# EAGLE board Aquila-2019-ex (EAGLE 9.2.1), part 1 of 2
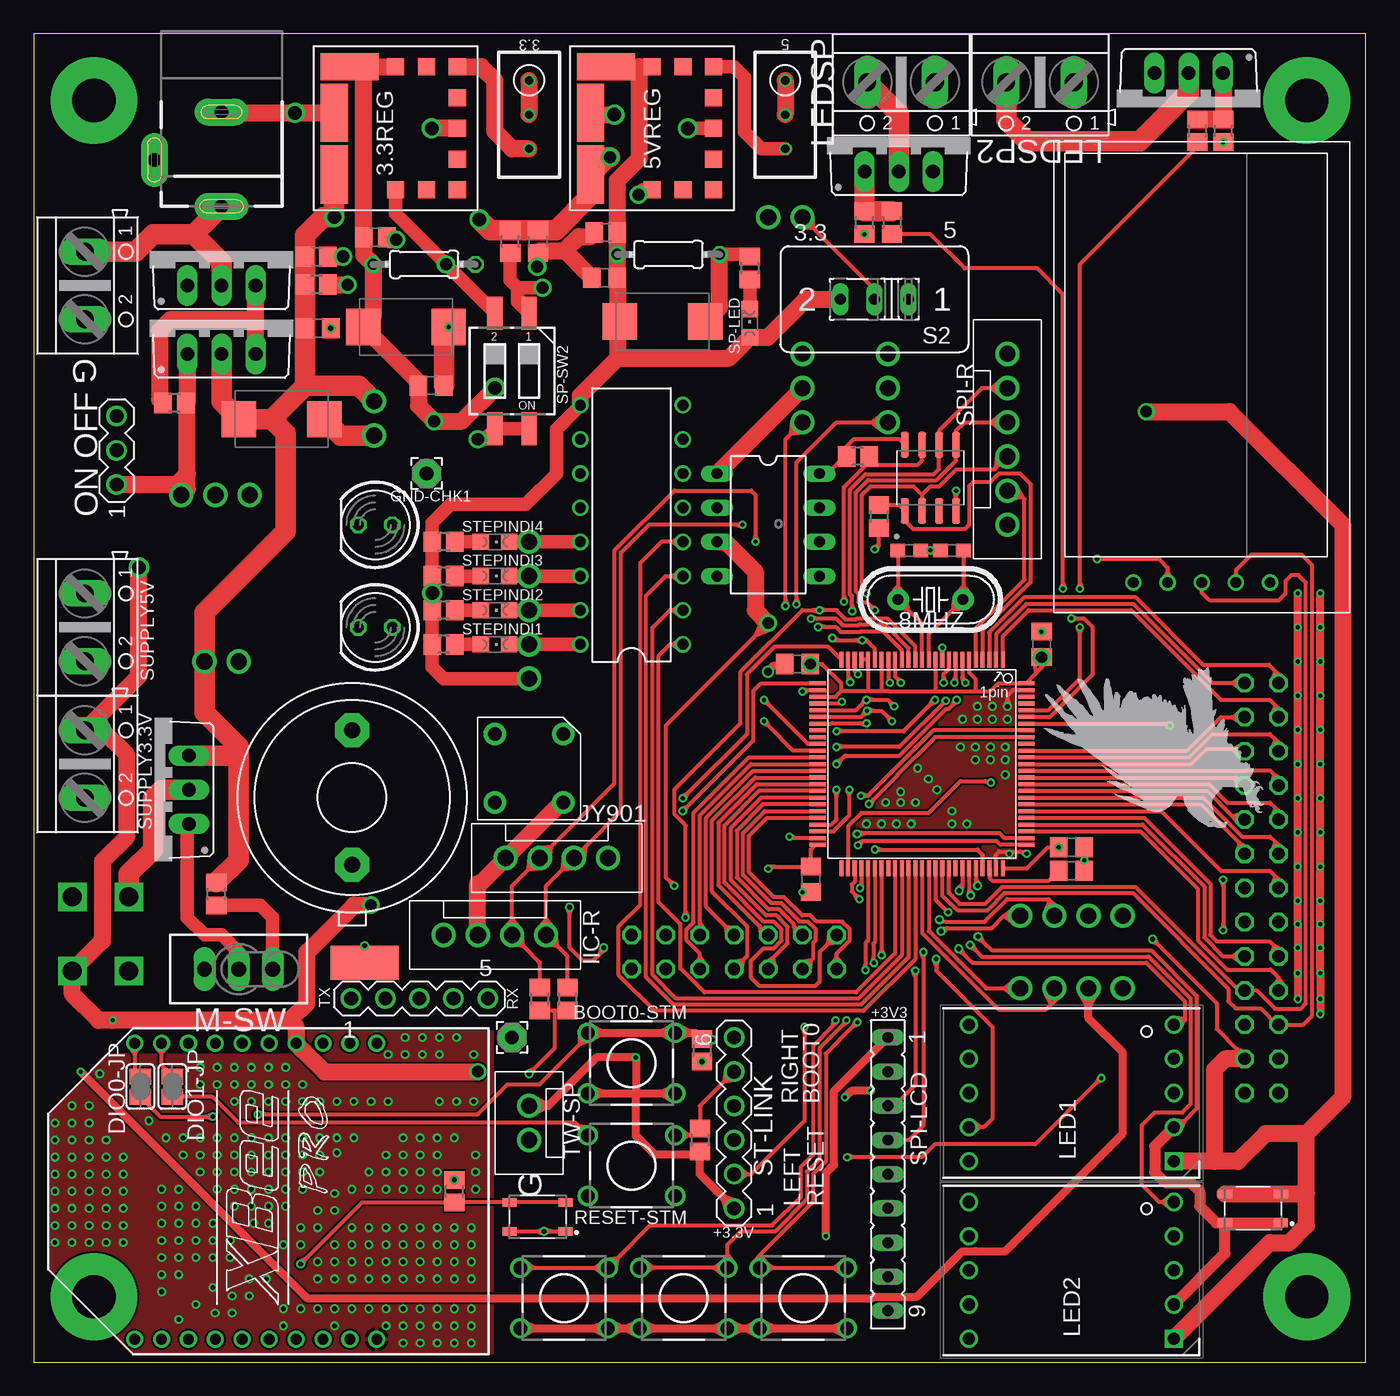
[diagram p6: board, top side]
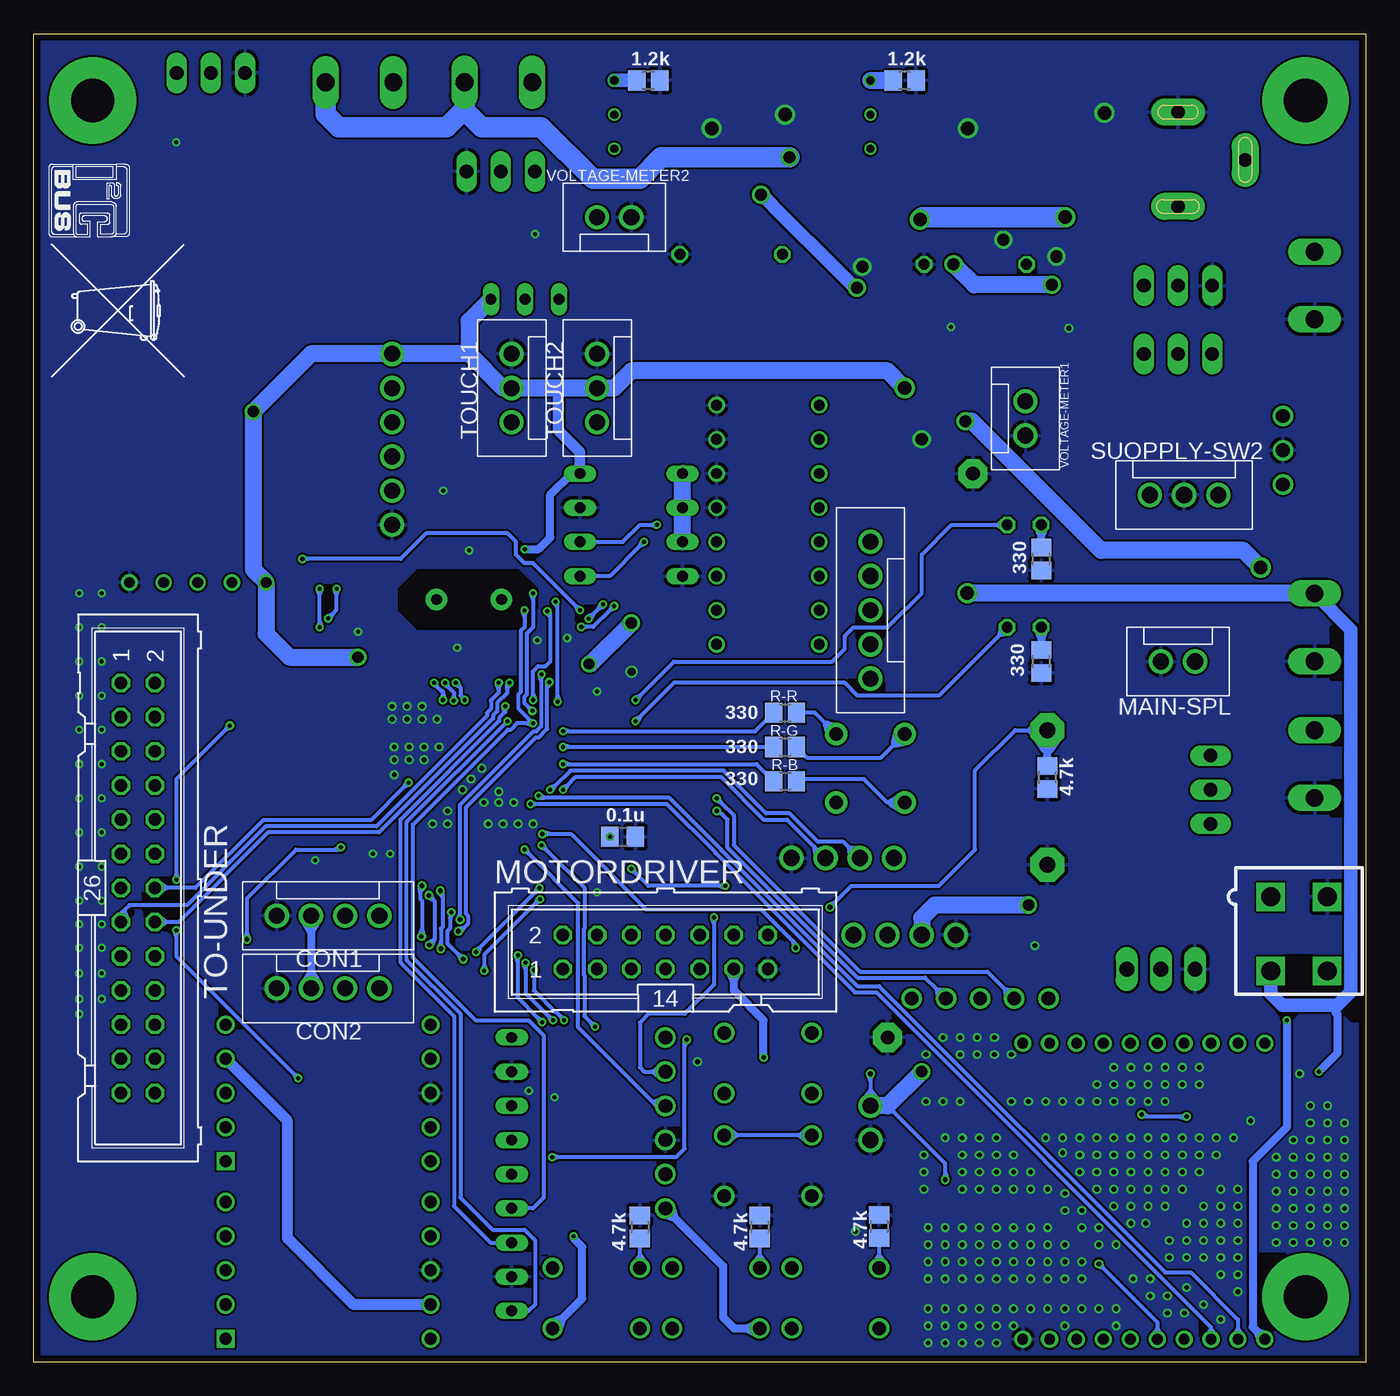
[diagram p7: board, bottom side, seen from below]

Size 99.04 x 98.73 mm. Coordinates in mm from the lower left corner, seen from the top.
Outline: 0,0 99.04,0 99.04,98.73 0,98.73 0,0
Copper layers (1*16): Top 0.035mm / dielectric 1.6mm / Bottom 0.035mm
Design rules "Elecrow_2-layer_PCB_eagle_rule": minimum track width 6mil, minimum drill 12mil, track to track 6mil, track to pad 6mil, pad to pad 6mil, via to via 8mil, smd to smd 0mil, copper to edge 20mil, drill to drill 10mil, minimum pad ring 6mil, minimum via ring 6mil, stop-mask expansion 0mil, vias tented up to drill 100mil, thermal gap 10mil
tRestrict: 2 lines
bRestrict: 87 lines

## Footprints (pad centres in the part's own frame; a part is rotated, then mirrored left to right if it is on the bottom)
D/7343-31R = smd 2.55 x 2.7: + 3.175,0; - -3.175,0
C0805 = smd 1.3 x 1.5: 1 -0.95,0; 2 0.95,0
OKL-T/3-W5 = smd 1.27 x 1.27: 1 -10.67,6.1; 5 -1.52,6.1; 6 -1.52,1.52; 7 -6.09,1.52; 8 -8.38,1.52; 9 -10.67,1.52; 10 -10.67,3.81; 11 -1.52,3.81; 12 -3.81,1.52 | smd 4.32 x 2.03: 2 -9.53,10.67; 3 -4.95,10.67 | smd 2.03 x 4.32: 4 -1.52,9.53
HC49U-V = drill 0.8 pad 1.6: 1 -2.413,0; 2 2.413,0
DTS-6 = drill 1: 1 -3.25,2.25; 2 3.25,2.25; 3 -3.25,-2.25; 4 3.25,-2.25
C2012 = smd 1.3 x 1.5: 1 -0.85,0; 2 0.85,0
C1608 = smd 1.1 x 1: 1 -0.85,0; 2 0.85,0
OSTA71A1D-A = drill 1 pad 1.676: ANODE 2.54,2.54; BLUE 2.54,-2.54; GREEN -2.54,-2.54; RED -2.54,2.54
CON4 = drill 1.2: P$1 -3.81,0; P$2 -1.27,0; P$3 1.27,0; P$4 3.81,0
SJ = smd 1.168 x 1.6: 1 -0.762,0; 2 0.762,0
R0805 = smd 1.3 x 1.5: 1 -0.85,0; 2 0.85,0
TO220BV = drill 1.016 long: D 0,-2.54; G -2.54,-2.54; S 2.54,-2.54
SMD2,54-5,08 = smd 2.54 x 5.08: 1 0,0
2,15/1,0 = drill 1.016 pad 2.159 octagon: 1 0,0
LQFP100 = smd 0.3 x 1.2: 1 -6,-7.75; 2 -5.5,-7.75; 3 -5,-7.75; 4 -4.5,-7.75; 5 -4,-7.75; 6 -3.5,-7.75; 7 -3,-7.75; 8 -2.5,-7.75; 9 -2,-7.75; 10 -1.5,-7.75; 11 -1,-7.75; 12 -0.5,-7.75; 13 0,-7.75; 14 0.5,-7.75; 15 1,-7.75; 16 1.5,-7.75; 17 2,-7.75; 18 2.5,-7.75; 19 3,-7.75; 20 3.5,-7.75; 21 4,-7.75; 22 4.5,-7.75; 23 5,-7.75; 24 5.5,-7.75; 25 6,-7.75; 51 6,7.75; 52 5.5,7.75; 53 5,7.75; 54 4.5,7.75; 55 4,7.75; 56 3.5,7.75; 57 3,7.75; 58 2.5,7.75; 59 2,7.75; 60 1.5,7.75; 61 1,7.75; 62 0.5,7.75; 63 0,7.75; 64 -0.5,7.75; 65 -1,7.75; 66 -1.5,7.75; 67 -2,7.75; 68 -2.5,7.75; 69 -3,7.75; 70 -3.5,7.75; 71 -4,7.75; 72 -4.5,7.75; 73 -5,7.75; 74 -5.5,7.75; 75 -6,7.75 | smd 1.2 x 0.3: 26 7.75,-6; 27 7.75,-5.5; 28 7.75,-5; 29 7.75,-4.5; 30 7.75,-4; 31 7.75,-3.5; 32 7.75,-3; 33 7.75,-2.5; 34 7.75,-2; 35 7.75,-1.5; 36 7.75,-1; 37 7.75,-0.5; 38 7.75,0; 39 7.75,0.5; 40 7.75,1; 41 7.75,1.5; 42 7.75,2; 43 7.75,2.5; 44 7.75,3; 45 7.75,3.5; 46 7.75,4; 47 7.75,4.5; 48 7.75,5; 49 7.75,5.5; 50 7.75,6; 76 -7.75,6; 77 -7.75,5.5; 78 -7.75,5; 79 -7.75,4.5; 80 -7.75,4; 81 -7.75,3.5; 82 -7.75,3; 83 -7.75,2.5; 84 -7.75,2; 85 -7.75,1.5; 86 -7.75,1; 87 -7.75,0.5; 88 -7.75,0; 89 -7.75,-0.5; 90 -7.75,-1; 91 -7.75,-1.5; 92 -7.75,-2; 93 -7.75,-2.5; 94 -7.75,-3; 95 -7.75,-3.5; 96 -7.75,-4; 97 -7.75,-4.5; 98 -7.75,-5; 99 -7.75,-5.5; 100 -7.75,-6
DIL16 = drill 0.813: 1 -8.89,-3.81; 2 -6.35,-3.81; 3 -3.81,-3.81; 4 -1.27,-3.81; 5 1.27,-3.81; 6 3.81,-3.81; 7 6.35,-3.81; 8 8.89,-3.81; 9 8.89,3.81; 10 6.35,3.81; 11 3.81,3.81; 12 1.27,3.81; 13 -1.27,3.81; 14 -3.81,3.81; 15 -6.35,3.81; 16 -8.89,3.81
DIL08 = drill 0.813 long: 1 -3.81,-3.81; 2 -1.27,-3.81; 3 1.27,-3.81; 4 3.81,-3.81; 5 3.81,3.81; 6 1.27,3.81; 7 -1.27,3.81; 8 -3.81,3.81
AE-AQM0802 = drill 0.8: GND -15.24,-5.08; RESET -15.24,2.54; SCL -15.24,0; SDA -15.24,-2.54; VDD -15.24,5.08
CON5 = drill 1.2: P$1 -5.08,0; P$2 -2.54,0; P$3 0,0; P$4 2.54,0; P$5 5.08,0
LED5MM = drill 0.813 octagon: A -1.27,0; K 1.27,0
DIPS1524W50P254L1260H800Q10N = drill 0.9 pad 1.35 square: 1 0,0 | drill 0.9 pad 1.35: 2 0,-2.54; 3 0,-5.08; 4 0,-7.62; 5 0,-10.16; 6 15.24,-10.16; 7 15.24,-7.62; 8 15.24,-5.08; 9 15.24,-2.54; 10 15.24,0
AK500/2 = drill 1.321 long: 1 -2.515,0; 2 2.515,0
TL3XPO = drill 1.1 pad 1.422 long: 1 -2.54,0; 2 0,0; 3 2.54,0
CON2 = drill 1.2: P$1 -1.27,0; P$2 1.27,0
MA03-1 = drill 1.016: 1 -2.54,0; 2 0,0; 3 2.54,0
ML14 = drill 0.914 octagon: 1 -7.62,-1.27; 2 -7.62,1.27; 3 -5.08,-1.27; 4 -5.08,1.27; 5 -2.54,-1.27; 6 -2.54,1.27; 7 0,-1.27; 8 0,1.27; 9 2.54,-1.27; 10 2.54,1.27; 11 5.08,-1.27; 12 5.08,1.27; 13 7.62,-1.27; 14 7.62,1.27
0204/7 = drill 0.813 octagon: 1 -3.81,0; 2 3.81,0
SW_SKRPACE010 = smd 1.05 x 0.65: 1 -2.075,1.075; 2 2.075,1.075; 3 -2.075,-1.075; 4 2.075,-1.075
M251 = drill 0.813 long: 1 -2.54,0; 2 0,0; 3 2.54,0
F/EE17P = drill 1.194 pad 2.54 octagon: 1 -5.004,0; 2 5.004,0
CHIPLED_0805 = smd 1.2 x 1.2: A 0,-1.05; C 0,1.05
RTRIM3296W = drill 0.61: 1 0,-2.54; 2 0,0; 3 0,2.54
CTS-219-02 = smd 1.13 x 2.44: 1 -1.27,-4.3; 2 1.27,-4.3; 3 1.27,4.3; 4 -1.27,4.3
FE09 = drill 0.813 long: 1 -10.16,0; 2 -7.62,0; 3 -5.08,0; 4 -2.54,0; 5 0,0; 6 2.54,0; 7 5.08,0; 8 7.62,0; 9 10.16,0
CON6 = drill 1.2: P$1 -6.35,0; P$2 -3.81,0; P$3 -1.27,0; P$4 1.27,0; P$5 3.81,0; P$6 6.35,0
CON3 = drill 1.2: P$1 -2.54,0; P$2 0,0; P$3 2.54,0
MA06-1 = drill 1.016: 1 -6.35,0; 2 -3.81,0; 3 -1.27,0; 4 1.27,0; 5 3.81,0; 6 6.35,0
ML26 = drill 0.914 octagon: 1 -15.24,-1.27; 2 -15.24,1.27; 3 -12.7,-1.27; 4 -12.7,1.27; 5 -10.16,-1.27; 6 -10.16,1.27; 7 -7.62,-1.27; 8 -7.62,1.27; 9 -5.08,-1.27; 10 -5.08,1.27; 11 -2.54,-1.27; 12 -2.54,1.27; 13 0,-1.27; 14 0,1.27; 15 2.54,-1.27; 16 2.54,1.27; 17 5.08,-1.27; 18 5.08,1.27; 19 7.62,-1.27; 20 7.62,1.27; 21 10.16,-1.27; 22 10.16,1.27; 23 12.7,-1.27; 24 12.7,1.27; 25 15.24,-1.27; 26 15.24,1.27
MA05-1 = drill 1.016: 1 -5.08,0; 2 -2.54,0; 3 0,0; 4 2.54,0; 5 5.08,0
SOIC127P600X175-8N = smd 1.91 x 0.6: 1 -2.46,1.905; 2 -2.46,0.635; 3 -2.46,-0.635; 4 -2.46,-1.905; 5 2.46,-1.905; 6 2.46,-0.635; 7 2.46,0.635; 8 2.46,1.905
5566-04A = drill 1.4 square: 1 2.1,-2.75; 2 -2.1,-2.75; 3 2.1,2.75; 4 -2.1,2.75
MJ-179P = drill 1 pad 2 long: 1 3,0; 2 -4,0; 3 -0.45,-5
XBEE-PRO = drill 0.8 pad 1.27: 1 -11,9; 2 -11,7; 3 -11,5; 4 -11,3; 5 -11,1; 6 -11,-1; 7 -11,-3; 8 -11,-5; 9 -11,-7; 10 -11,-9; 11 11,-9; 12 11,-7; 13 11,-5; 14 11,-3; 15 11,-1; 16 11,1; 17 11,3; 18 11,5; 19 11,7; 20 11,9

## Placement (x,y rotation side)
3.3C1  100u  [D/7343-31R]  27.68,76.93 180 top
3.3C2  0.1u  [C0805]  29.56,72.57 0 top
3.3REG  OKL-T_6-W12N-C  [OKL-T/3-W5]  33.02,97.79 90 top
5C1  100u  [D/7343-31R]  46.76,77.33 180 top
5C2  0.1u  [C0805]  42.44,80.59 180 top
5VREG  OKL-T_6-W12N-C  [OKL-T/3-W5]  52.07,97.79 90 top
8MHZ  P-08669_HUSG-12.000-20  [HC49U-V]  66.67,56.67 0 top
9C1  100u  [D/7343-31R]  18.45,70.08 180 top
9C2  0.1u  [C0805]  21.13,76.84 0 top
BOOT0-STM  DTS-6  [DTS-6]  44.45,22.23 180 top
C1  22uF25V  [C2012]  37.49,83.29 270 top
C2  10uF10V  [C2012]  42.55,83.95 180 top
C3  22uF25V  [C2012]  21.03,82.14 0 top
C4  10uF10V  [C2012]  25.4,83.59 0 top
C5  22pF  [C1608]  68.26,60.32 0 top
C6  22pF  [C1608]  65.09,60.32 180 top
CHECKLED  OSTA71A1D-A  [OSTA71A1D-A]  36.83,44.13 270 top
CON1  XH-4  [CON4]  77.15,33.18 180 bottom
CON2  XH-4  [CON4]  77.15,27.78 180 bottom
DIO0-JP  BOOT0  [SJ]  7.94,20.48 90 top
DIO1-JP  NRST  [SJ]  10.32,20.48 90 top
ERROR1-R  330  [R0805]  24.13,59.69 90 bottom
ERROR2-R  330  [R0805]  24.13,52.07 90 bottom
FET1  IRF740  [TO220BV]  64.31,91.03 0 top
FET1-R1  100  [R0805]  63.8,84.68 270 top
FET1-R2  4.7K  [R0805]  61.77,84.68 90 top
FET2  IRF740  [TO220BV]  85.86,93.28 180 top
FET2-R1  100  [R0805]  86.51,91.51 270 top
FET2-R2  4.7K  [R0805]  88.44,91.51 90 top
GND-CH  GND  [SMD2,54-5,08]  24.61,29.69 270 top
GND-CHK  GND  [2,15/1,0]  35.56,24.13 0 top
GND-CHK1  GND  [2,15/1,0]  29.21,66.04 0 top
I2C-R1  4.7k  [R0805]  39.69,26.99 270 top
I2C-R2  4.7k  [R0805]  37.62,26.99 270 top
IC1  STM32F429VGT  [LQFP100]  66.04,44.45 180 top
IC2  ULN2003AN  [DIL16]  44.45,62.23 90 top
IC3  AT24CP  [DIL08]  54.61,62.23 270 top
IC4  AE-AQM0802  [AE-AQM0802]  86.84,73.18 90 top
IIC-R  XH-4  [CON4]  34.29,31.75 180 top
INDILED1  330  [R0805]  30.48,53.34 180 top
INDILED2  330  [R0805]  30.48,55.88 180 top
INDILED3  330  [R0805]  30.48,58.42 180 top
INDILED4  330  [R0805]  30.48,60.96 180 top
J1  XH-5  [CON5]  36.83,55.88 90 bottom
JY901  XH-4  [CON4]  38.89,37.46 180 top
L3  E1  [LED5MM]  25.4,62.23 180 top
L4  E2  [LED5MM]  25.4,54.61 180 top
LED1  OSL10564-CD4026B-R  [DIPS1524W50P254L1260H800Q10N]  84.77,14.92 180 top
LED2  OSL10564-CD4026B-R  [DIPS1524W50P254L1260H800Q10N]  84.77,1.75 180 top
LEDSP  MAIN  [AK500/2]  64.49,95.12 180 top
LEDSP2  MAIN  [AK500/2]  74.82,95.11 180 top
M-SW  TL36PO  [TL3XPO]  15.24,29.21 180 top
MAIN-SPL  XH-2  [CON2]  13.97,52.07 180 bottom
MAINSW2  MAIN  [MA03-1]  6.17,67.77 90 top
MOTORDRIVER  MDCON  [ML14]  52.07,30.48 0 bottom
Q3  IRF9530  [TO220BV]  13.97,82.55 0 top
Q4  IRF9530  [TO220BV]  9.02,42.54 90 top
Q5  IRF9530  [TO220BV]  13.97,77.47 0 top
R1  1.2k  [0204/7]  47.19,82.32 0 top
R2  1.2k  [0204/7]  29.03,81.58 0 top
R-B  ?  [R0805]  43.18,43.18 0 bottom
R-G  ?  [R0805]  43.18,45.72 0 bottom
R-R  ?  [R0805]  43.18,48.26 0 bottom
RESET-STM  DTS-6  [DTS-6]  44.45,14.61 180 top
S1  SKRPACE010  [SW_SKRPACE010]  37.47,10.79 180 top
S2  VM  [M251]  62.51,78.99 180 top
S3  SKRPACE010  [SW_SKRPACE010]  90.65,11.43 180 top
SG1  F/EE17P  [F/EE17P]  23.67,41.96 270 top
SL-R1  1K  [R0805]  53.24,81.31 270 top
SP-LED  [CHIPLED_0805]  53.24,77.22 0 top
SP-R1  1.2k  [R0805]  53.34,95.25 180 bottom
SP-R2  20K  [R0805]  35.43,83.29 90 top
SP-R3  1.2k  [R0805]  34.29,95.25 180 bottom
SP-R4  20K  [R0805]  21.03,80.09 180 top
SP-R5  4.7K  [R0805]  13.59,34.8 90 top
SP-R6  4.7K  [R0805]  10.48,71.28 180 top
SP-RC1  20k  [RTRIM3296W]  55.88,92.71 180 top
SP-RC2  20k  [RTRIM3296W]  36.83,92.71 180 top
SP-SW2  219-02  [CTS-219-02]  35.56,73.66 180 top
SPI-LCD  [FE09]  63.5,13.97 270 top
SPI-R  XH-6  [CON6]  72.39,68.58 270 top
SRAM-R1  4.7K  [R0805]  62.84,62.85 270 top
SRAM-R2  10k  [R0805]  61.28,67.31 180 top
STEPINDI1  LED  [CHIPLED_0805]  34.29,53.34 270 top
STEPINDI2  LED  [CHIPLED_0805]  34.29,55.88 270 top
STEPINDI3  LED  [CHIPLED_0805]  34.29,58.42 270 top
STEPINDI4  LED  [CHIPLED_0805]  34.29,60.96 270 top
STM-C1  0.1u  [C0805]  56.79,51.88 0 top
STM-C2  0.1u  [C0805]  74.93,53.34 270 top
STM-C3  0.1u  [C0805]  57.78,35.88 90 top
STM-C4  0.1u  [C0805]  77.15,38.26 180 top
STM-C5  0.1u  [C0805]  77.15,36.51 0 top
STM-C6  0.1u  [C0805]  55.24,39.05 0 bottom
STM-R1  4.7K  [R0805]  49.53,16.51 270 top
STM-R2  4.7K  [R0805]  49.69,23.18 270 top
SUOPPLY-SW2  XH-3  [CON3]  13.52,64.45 180 bottom
SUPPLY3.3V  MAIN  [AK500/2]  3.81,44.45 270 top
SUPPLY5V  MAIN  [AK500/2]  3.81,54.61 270 top
SUPPLY9  MAIN  [AK500/2]  3.81,80.01 270 top
SV1  [MA06-1]  52.07,17.78 90 top
TESTSW-R1  4.7K  [R0805]  36.18,10.07 270 bottom
TESTSW-R2  4.7K  [R0805]  45.06,10.06 270 bottom
TESTSW-R3  4.7K  [R0805]  53.98,10.06 270 bottom
TO-UNDER  [ML26]  91.28,35.24 270 bottom
TOUCH1  XH-3  [CON3]  63.5,72.39 90 bottom
TOUCH2  XH-3  [CON3]  57.15,72.39 90 bottom
TW-SP  XH-2  [CON2]  36.83,17.78 90 top
TWILITE  C2  [MA05-1]  28.68,27.03 0 top
U2  23K256-I/SN  [SOIC127P600X175-8N]  66.67,65.72 90 top
U$1  [EAGLE-PLC-12MM]  91.44,39.69 90 top
U$2  5566-04A  [5566-04A]  4.98,31.83 180 bottom
U$3  [I2C]  97.95,89.06 270 bottom
U$4  [TONNE_10.00]  94.77,78.26 270 bottom
U$5  [LOGO]  55.72,58.58 90 top
VOLTAGE-METER1  XH-2  [CON2]  25.31,70.14 270 bottom
VOLTAGE-METER2  XH-2  [CON2]  55.88,85.09 0 bottom
X2  DCJACK-MJ179P  [MJ-179P]  13.97,88.9 270 top
X-R2  4.7K  [R0805]  23.67,43.46 90 bottom
XB1  XBEE-PRO  [XBEE-PRO]  16.51,12.7 90 top
XBEE-RST  4.7K  [R0805]  31.27,12.7 90 top
XMEGA-TEST1  SW1  [DTS-6]  39.43,4.76 180 top
XMEGA-TEST2  SW2  [DTS-6]  48.32,4.76 180 top
XMEGA-TEST3  SW3  [DTS-6]  57.21,4.76 180 top

## Tracks (layer width: path | path; a pad name or v marks a point on that pad's centre or on a via)
+3V3  (via drill 0.3, 0.35, 0.8, 0.85, 0.9, 1)
  Top 0.152: 58.13,38.45 IC1.50
  Top 0.305: IC1.28 59.61,49.45 60.04,49.88 | 60.04,49.88 60.04,50.45 58.61,51.88 STM-C1.2 | 74.52,51.18 IC1.100 71.72,50.45 71.14,49.87 70.01,49.87 | 74.52,51.18 74.93,51.59 STM-C2.2 | STM-C2.2 | 60.04,49.88 62.03,49.88 | 62.03,49.88 63.02,49.88 | 63.02,49.88 63.56,49.88 63.56,49.87 66.99,49.87 | 66.99,49.87 70.01,49.87 | 62.03,49.88 62.04,49.89 IC1.21 IC1.22 | IC1.11 67.04,49.92 66.99,49.87 | 58.13,38.45 57.78,38.1 STM-C3.2 55.04,36.83 | U2.8 64.37,68.58 60.96,68.58 60.43,68.05 60.43,67.47 | 60.43,67.47 SRAM-R2.2 | v54.61,54.93 53.71,54.03 | 53.71,54.03 46.99,47.31 46.99,36.04 47.3,35.72 | 47.3,35.72 v47.62,35.4 | v54.61,36.67 54.77,36.83 55.04,36.83 | v62.52,60.41 62.84,60.73 62.84,60.74 | 62.84,60.74 SRAM-R1.2 | IC3.8 59,66.04 60.43,67.47 | IC1.6 69.54,51.27 70.01,50.8 70.01,49.87 | v83.19,31.43 83.56,31.06 | 83.56,31.06 87.95,26.67 87.95,24.77 89.45,23.26 | 89.45,23.26 90.01,22.7 TO-UNDER.24 | IC1.75 73.85,36.7 75.41,38.26 75.75,38.26 | 75.75,38.26 STM-C4.2 | I2C-R2.2 38.73,26.14 | 38.73,26.14 I2C-R1.2 | 38.73,26.14 38.73,23.34 37.2,21.8 | 37.2,21.8 v36.83,21.43 | 63.02,49.88 63.04,49.9 IC1.19 | 62.84,60.74 62.45,60.55 v62.52,60.41 | 62.84,60.74 62.66,60.35 v62.52,60.41 | 53.71,54.03 54.8,54.48 v54.61,54.93 | 53.71,54.03 54.16,55.11 v54.61,54.93 | 74.52,51.18 75.3,52.07 STM-C2.2 | 74.52,51.18 74.45,52.36 STM-C2.2 | 47.3,35.72 47.49,35.34 v47.62,35.4 | 47.3,35.72 47.69,35.54 v47.62,35.4 | 55.04,36.83 54.61,36.82 v54.61,36.67 | 55.04,36.83 54.71,36.55 v54.61,36.67 | 83.56,31.06 83.34,31.51 v83.19,31.43 | 83.56,31.06 83.11,31.28 v83.19,31.43 | 75.75,38.26 76.15,38.11 STM-C4.2 | 75.75,38.26 76.15,38.4 STM-C4.2 | 37.2,21.8 36.76,21.59 v36.83,21.43
  Top 0.305: 37.2,21.8 36.99,21.36 v36.83,21.43 | 89.45,23.26 89.48,22.52 TO-UNDER.24 | 89.45,23.26 90.16,23.05 TO-UNDER.24
  Top 0.61: XMEGA-TEST1.2 37.18,2.51 | 37.18,2.51 41.68,2.51 | 41.68,2.51 XMEGA-TEST1.1 | XMEGA-TEST1.1 43.68,2.51 | 43.68,2.51 44.07,2.51 | 44.07,2.51 XMEGA-TEST2.2 | XMEGA-TEST2.2 46.07,2.51 | 46.07,2.51 50.57,2.51 | 50.57,2.51 XMEGA-TEST2.1 | XMEGA-TEST2.1 52.57,2.51 | 52.57,2.51 52.96,2.51 | 52.96,2.51 XMEGA-TEST3.2 | XMEGA-TEST3.2 54.96,2.51 | 54.96,2.51 59.46,2.51 | 59.46,2.51 XMEGA-TEST3.1 | 38.03,19.05 38.26,19.05 41.85,22.64 v44.77,22.64 44.77,19.98 | 38.03,19.05 TW-SP.P$2 | v58.9,9.37 58.9,14.06 59.51,14.67 59.51,20.14 SPI-LCD.1 | BOOT0-STM.2 42.2,19.98 | 42.2,19.98 44.77,19.98 | 44.77,19.98 46.7,19.98 | 46.7,19.98 BOOT0-STM.1 | SV1.1 51.35,12.15 | 51.35,12.15 49.53,13.97 STM-R1.2 49.27,15.4 46.2,15.4 44.77,16.83 44.77,19.98 | 38.03,19.05 37.12,19.57 TW-SP.P$2 | 38.03,19.05 37.12,18.53 TW-SP.P$2 | 44.07,2.51 44.88,2.11 XMEGA-TEST2.2 | 44.07,2.51 44.88,2.91 XMEGA-TEST2.2 | 46.07,2.51 45.27,2.91 XMEGA-TEST2.2 | 46.07,2.51 45.27,2.11 XMEGA-TEST2.2 | 41.68,2.51 42.48,2.11 XMEGA-TEST1.1 | 41.68,2.51 42.48,2.91 XMEGA-TEST1.1 | 43.68,2.51 42.88,2.91 XMEGA-TEST1.1 | 43.68,2.51 42.88,2.11 XMEGA-TEST1.1 | 37.18,2.51 36.38,2.91 XMEGA-TEST1.2 | 37.18,2.51 36.38,2.11 XMEGA-TEST1.2 | 50.57,2.51 51.38,2.11 XMEGA-TEST2.1 | 50.57,2.51 51.38,2.91 XMEGA-TEST2.1 | 52.57,2.51 51.77,2.91 XMEGA-TEST2.1 | 52.57,2.51 51.77,2.11 XMEGA-TEST2.1 | 52.96,2.51 53.77,2.11 XMEGA-TEST3.2 | 52.96,2.51 53.77,2.91 XMEGA-TEST3.2 | 54.96,2.51 54.16,2.91 XMEGA-TEST3.2 | 54.96,2.51 54.16,2.11 XMEGA-TEST3.2 | 59.46,2.51 60.27,2.11 XMEGA-TEST3.1 | 59.46,2.51 60.27,2.91 XMEGA-TEST3.1 | 51.35,12.15 51.64,11.29 SV1.1 | 51.35,12.15 52.21,11.86 SV1.1 | 46.7,19.98 47.5,19.58 BOOT0-STM.1
  Top 0.61: 46.7,19.98 47.5,20.37 BOOT0-STM.1 | 42.2,19.98 41.4,20.37 BOOT0-STM.2 | 42.2,19.98 41.4,19.58 BOOT0-STM.2
  Top 1.27: 19.05,25.4 20.32,26.67 20.32,30.48 23.81,33.97 v25.08,33.97 | v7.82,59.05 7.82,50.98 SUPPLY3.3V.1 5.11,46.96 6.91,45.16 6.91,39.01 5.11,37.21 5.11,31.3 U$2.4 2.88,27.35 4.83,25.4 v5.87,25.4 19.05,25.4 | 3.3REG.4 24.89,96.27 | 24.89,96.27 3.3REG.5 | v34.29,72.39 31.83,69.93 v29.77,69.93 28.61,71.09 3.3C2.1 28.61,72.83 3.3C1.+ 25.22,77.65 R2.1 24.55,82.26 C4.1 24.55,95.93 24.89,96.27 | IC3.1 TOUCH2.P$2 | IC3.3 51.44,60.96 53.66,58.74 53.66,55.88 v54.61,54.93 | IIC-R.P$3 33.02,35.56 33.18,35.56 JY901.P$4 39.21,41.59 CHECKLED.ANODE | 19.05,25.4 19.51,24.94 XB1.14 20.09,23.12 20.09,23.11 21.62,21.58 33.01,21.58 v33.02,21.59 | v82.71,70.64 88.9,70.64 97.31,62.23 97.31,19.68 94.61,16.99 | 94.61,16.99 91.6,16.99 89.53,14.92 87.79,14.92 | 87.79,14.92 LED1.1 | TO-UNDER.24 88.58,22.54 87.79,21.75 87.79,14.92 | LED2.1 91.92,8.89 93.34,8.89 94.61,10.16 94.61,12.54 | 94.61,12.54 94.61,16.99 | S3.4 S3.3 94.58,12.51 94.61,12.54
  Bottom 0.305: v47.62,35.4 48.08,35.4 | 48.08,35.4 53.34,35.4 54.29,36.35 | 54.29,36.35 v54.61,36.67 | XBEE-RST.2 31.27,14.08 | 31.27,14.08 31.27,14.76 35.56,19.05 | 83.19,31.96 83.19,34.45 79.53,38.1 76.63,38.1 | 83.19,31.96 v83.19,31.43 | 76.63,38.1 76.36,38.1 STM-C4.2 | v36.83,21.43 36.83,20.91 | 36.83,20.91 36.83,20.25 | 36.83,20.25 TW-SP.P$2 | 48.08,35.4 47.68,35.54 v47.62,35.4 | 48.08,35.4 47.68,35.26 v47.62,35.4 | 54.29,36.35 54.68,36.53 v54.61,36.67 | 54.29,36.35 54.47,36.74 v54.61,36.67 | 31.27,14.08 31.11,13.61 XBEE-RST.2 | 31.27,14.08 31.44,13.61 XBEE-RST.2 | 83.19,31.96 83.02,31.49 v83.19,31.43 | 83.19,31.96 83.35,31.49 v83.19,31.43 | 76.63,38.1 76.3,38.38 STM-C4.2 | 76.63,38.1 76.2,38.11 STM-C4.2 | 36.83,20.91 36.99,21.37 v36.83,21.43 | 36.83,20.91 36.66,21.37 v36.83,21.43 | 36.83,20.25 36.24,19.52 TW-SP.P$2 | 36.83,20.25 37.41,19.52 TW-SP.P$2
  Bottom 0.61: v62.52,60.41 61.51,60.41 60.64,61.28 60.64,64.45 59.05,66.04 IC3.8 | v44.77,22.64 44.77,25.4 46.99,27.62 46.99,28.3 | 46.99,28.3 MOTORDRIVER.11 | v5.87,25.4 5.87,17.46 8.41,14.92 8.41,2.6 8.08,2.27 | 8.08,2.27 XB1.1 | SV1.1 51.35,10.71 | 51.35,10.71 47.78,7.14 47.78,3.33 46.96,2.51 46.07,2.51 | 46.07,2.51 XMEGA-TEST2.2 | XMEGA-TEST3.1 59.76,3.22 | 59.76,3.22 58.26,4.71 58.26,8.57 58.9,9.21 v58.9,9.37 | 46.99,28.3 47.34,29.05 MOTORDRIVER.11 | 46.99,28.3 46.64,29.05 MOTORDRIVER.11 | 46.07,2.51 45.27,2.91 XMEGA-TEST2.2 | 46.07,2.51 45.27,2.11 XMEGA-TEST2.2 | 59.76,3.22 60.04,2.37 XMEGA-TEST3.1 | 59.76,3.22 60.6,2.94 XMEGA-TEST3.1 | 8.08,2.27 7.39,2.01 XB1.1 | 8.08,2.27 7.82,1.58 XB1.1 | 51.35,10.71 52.21,11 SV1.1 | 51.35,10.71 51.64,11.57 SV1.1
  Bottom 0.813: IC3.8 58.42,67.63 60.01,69.22 60.01,72.39
  Bottom 1.27: v7.82,59.05 9.09,60.32 19.68,60.32 29.29,69.93 v29.77,69.93 | v34.29,72.39 35.56,73.66 54.61,73.66 55.88,72.39 TOUCH2.P$2 60.01,72.39 TOUCH1.P$2 64.14,72.39 66.67,74.93 | 66.67,74.93 SPI-R.P$1 78.42,74.93 v82.71,70.64 82.71,58.9 IC4.VDD 81.76,54.13 80.01,52.39 STM-C2.2 | S2.1 66.67,77.37 66.67,74.93 | IC3.3 IC3.2 IC3.1 | v25.08,33.97 32.07,33.97 33.02,33.02 IIC-R.P$3 | v33.02,21.59 35.56,19.05 TW-SP.P$2 | STM-C1.2 57.66,51.88 v54.61,54.93
  other vias: 74.93,52.39 31.27,13.55 76.2,38.26 57.74,51.88
+5V  (via drill 0.3, 1)
  Top 0.305: 5C1.+ 43.45,77.47 43.39,77.47
  Top 0.61: v3.49,21.59 20.32,4.76 62.33,4.76 62.45,4.88 65.68,4.88 69.03,8.23 70,8.23 70.02,8.26 72.23,8.26 80.96,16.99 80.96,23.02 78.42,25.56 78.42,26.58 | 78.42,26.58 CON2.P$3 | 78.42,26.58 78.94,27.49 CON2.P$3 | 78.42,26.58 77.91,27.49 CON2.P$3
  Top 1.016: J1.P$1 30.48,50.8 29.63,51.65 INDILED1.2 INDILED2.2 v29.63,57.15 INDILED3.2 INDILED4.2 29.63,62.4 30.99,63.75 36.58,63.75 38.86,66.04 38.86,69.34 IC2.9
  Top 1.27: 5VREG.4 45.01,96.27 | 45.01,96.27 5VREG.5 | 45.01,96.27 45.01,89.43 43.38,87.81 43.38,83.96 C2.1 43.38,83.94 R1.1 43.38,80.6 5C2.1 43.39,77.47 43.39,74.61 | IC2.9 40.64,71.86 43.39,74.61 | 43.39,74.61 51.68,74.61 SP-LED.A 54.58,76.17 57.4,78.99 S2.3
  Bottom 0.61: v3.49,21.59 2.11,22.97 2.11,25.83 2.25,25.97 2.25,26.36 2.11,26.5 2.11,26.54 | CON1.P$3 78.42,31.98 | 78.42,31.98 78.42,28.98 | 78.42,28.98 CON2.P$3 | 78.42,31.98 78.94,32.88 CON1.P$3 | 78.42,31.98 77.91,32.88 CON1.P$3 | 78.42,28.98 77.91,28.08 CON2.P$3 | 78.42,28.98 78.94,28.08 CON2.P$3
  Bottom 1.016: SUPPLY5V.1 1.12,54.43 1.12,27.53 2.11,26.54 6.22,26.54 7.08,27.4 U$2.3
  Bottom 1.27: SUPPLY5V.1 29.61,57.12 v29.63,57.15
+9V  (via drill 0.9, 1)
  Top 1.524: 3.3REG.2 v22.35,85.09 21.54,85.09 20.18,83.73 C3.1 SP-R4.2 9C2.1 | SP-R5.2 15.24,37.3 15.24,45.72 | v33.15,84.91 33.92,84.14 SP-R2.2 C1.1 38.82,84.14 41.4,86.71 5VREG.2 42.67,89.54 v42.86,89.54 | Q4.S 14.61,45.08 15.24,45.72 | 15.24,45.72 12.7,48.26 MAIN-SPL.P$1 12.7,55.72 18.73,61.75 18.73,69.04 17.69,70.08 | Q5.D 13.97,71.38 9C1.+ 17.69,70.08 | 9C2.1 | 20.18,72.57 9C2.1 | 17.69,70.08 20.18,72.57 | VOLTAGE-METER1.P$1 24.15,72.57 20.18,72.57
  Bottom 1.524: v22.35,85.09 32.97,85.09 v33.15,84.91 | v42.86,89.54 52.39,89.54 53.98,87.95 57.47,87.95 61.3,91.78 65.73,91.78 67,93.05 LEDSP.1 67,93.12 68.34,91.78 76.38,91.78 77.33,92.73 LEDSP2.1
BUZZER  (via drill 0.35)
  Top 0.305: IC1.77 72.17,38.95 71.83,39.29 61.74,39.29 | v42.39,30.8 42.39,30.64 42.1,30.36 | 42.1,30.36 41.59,29.84 40.8,29.84 39.85,30.8 39.85,33.29 | 39.85,33.29 v39.85,33.81 | 61.74,39.29 61.22,39.29 v61.22,39.25 | 42.1,30.36 42.49,30.66 v42.39,30.8 | 42.1,30.36 42.22,30.84 v42.39,30.8 | 39.85,33.29 40.01,33.75 v39.85,33.81 | 39.85,33.29 39.68,33.75 v39.85,33.81 | 61.74,39.29 61.26,39.42 v61.22,39.25 | 61.74,39.29 61.28,39.09 v61.22,39.25
  Bottom 0.305: 42.58,31.28 44.95,33.65 53.5,33.65 59.1,39.25 60.69,39.25 | 42.58,31.28 42.39,31.09 v42.39,30.8 | v39.85,33.81 39.48,34.18 | 39.48,34.18 38.26,35.4 31.75,35.4 29.05,38.1 29.05,43.97 26.06,46.96 24.87,46.96 SG1.1 | v61.22,39.25 60.69,39.25 | 42.58,31.28 42.26,30.91 v42.39,30.8 | 42.58,31.28 42.56,30.79 v42.39,30.8 | 39.48,34.18 39.69,33.74 v39.85,33.81 | 39.48,34.18 39.92,33.97 v39.85,33.81 | 60.69,39.25 61.16,39.09 v61.22,39.25 | 60.69,39.25 61.16,39.42 v61.22,39.25
  Bottom 0.61: X-R2.2 23.67,45.77 SG1.1 | SG1.1 24.45,47.53 24.87,46.96 24.45,46.4 SG1.1
  Bottom 1.219: 23.67,45.77 24.22,46.6 SG1.1 23.12,46.6 23.67,45.77
CK
  Top 0.305: IC1.88 86.07,44.45 87.17,45.55 89.11,45.55 | 89.11,45.55 89.86,45.55 TO-UNDER.6 | 89.11,45.55 89.63,45.02 TO-UNDER.6 | 89.11,45.55 89.77,45.88 TO-UNDER.6
CL  (via drill 0.3, 0.35)
  Top 0.305: 70.43,17.46 70.64,17.46 71.28,18.1 71.28,24.92 67.1,29.1 67.1,29.43 | 70.43,17.46 LED1.9 | v67.1,29.95 67.1,29.43 | 67.1,29.43 67.27,29.89 v67.1,29.95 | 67.1,29.43 66.94,29.89 v67.1,29.95 | 70.43,17.46 69.84,17.89 LED1.9 | 70.43,17.46 69.84,17.04 LED1.9 | IC1.65 67.04,34.37 v67.98,33.43
  Bottom 0.305: 67.47,30.32 68.3,31.15 68.3,32.02 68.17,32.15 68.09,32.23 68.09,33.02 67.98,33.13 v67.98,33.43 | 67.47,30.32 v67.1,29.95 | 67.47,30.32 67.03,30.11 v67.1,29.95 | 67.47,30.32 67.26,29.88 v67.1,29.95
DIO0  (via drill 0.3, 0.35)
  Top 0.305: IC1.94 84.02,47.45 | 84.02,47.45 84.31,47.45 v84.45,47.31 | v88.42,35.85 88.42,35.39 | 88.42,35.39 88.42,32.55 | 88.42,32.55 v88.42,32.09 | 60.94,15.24 66.04,15.24 66.99,16.19 74.45,16.19 79.05,20.79 | 60.94,15.24 v60.48,15.24 | v79.38,21.11 79.05,20.79 | v50.48,23.97 50.43,24.03 49.96,24.03 | 49.96,24.03 STM-R2.1 | DIO0-JP.1 9.4,18.26 12.81,18.26 | 12.81,18.26 v13.34,18.26 | v16.67,18.41 17.19,18.41 | 17.19,18.41 33.02,18.41 35.24,20.64 37.62,20.64 40.64,23.65 | 40.64,23.65 41.2,24.21 BOOT0-STM.4 | 84.02,47.45 84.36,47.19 v84.45,47.31 | 84.02,47.45 84.45,47.46 v84.45,47.31 | 88.42,35.39 88.57,35.8 v88.42,35.85 | 88.42,35.39 88.28,35.8 v88.42,35.85 | 88.42,32.55 88.28,32.14 v88.42,32.09 | 88.42,32.55 88.57,32.14 v88.42,32.09 | 60.94,15.24 60.53,15.38 v60.48,15.24 | 60.94,15.24 60.53,15.1 v60.48,15.24 | 79.05,20.79 79.44,20.98 v79.38,21.11 | 79.05,20.79 79.24,21.18 v79.38,21.11 | 49.96,24.03 50.41,23.81 v50.48,23.97 | 49.96,24.03 50.44,24.14 v50.48,23.97 | 12.81,18.26 13.28,18.09 v13.34,18.26 | 12.81,18.26 13.28,18.42 v13.34,18.26 | 17.19,18.41 16.73,18.58 v16.67,18.41 | 17.19,18.41 16.73,18.25 v16.67,18.41 | 40.64,23.65 41.39,23.91 BOOT0-STM.4 | 40.64,23.65 40.6,24.45 BOOT0-STM.4
  Top 0.61: BOOT0-STM.4 42.2,24.48 | 42.2,24.48 46.7,24.48 | 46.7,24.48 BOOT0-STM.3 | BOOT0-STM.3 48.7,24.48 | 48.7,24.48 49.24,24.48 STM-R2.1 | 42.2,24.48 41.4,24.87 BOOT0-STM.4 | 42.2,24.48 41.4,24.08 BOOT0-STM.4 | 46.7,24.48 47.5,24.08 BOOT0-STM.3 | 46.7,24.48 47.5,24.87 BOOT0-STM.3 | 48.7,24.48 47.9,24.87 BOOT0-STM.3 | 48.7,24.48 47.9,24.08 BOOT0-STM.3
  Bottom 0.305: 88.42,36.31 88.42,43.34 84.78,46.98 | 88.42,36.31 v88.42,35.85 | v88.42,32.09 88.42,31.64 | 88.42,31.64 88.42,30.16 79.7,21.44 | v84.45,47.31 84.78,46.98 | 60.03,15.24 51.28,15.24 50.64,15.88 50.64,23.47 | 60.03,15.24 v60.48,15.24 | 79.7,21.44 v79.38,21.11 | v50.48,23.97 50.64,23.81 50.64,23.47 | v13.34,18.26 13.86,18.26 | 13.86,18.26 16.17,18.26 | 16.17,18.26 16.51,18.26 v16.67,18.41 | 84.78,46.98 84.59,47.37 v84.45,47.31 | 84.78,46.98 84.39,47.17 v84.45,47.31 | 88.42,36.31 88.28,35.9 v88.42,35.85 | 88.42,36.31 88.57,35.9 v88.42,35.85 | 88.42,31.64 88.57,32.04 v88.42,32.09 | 88.42,31.64 88.28,32.04 v88.42,32.09 | 60.03,15.24 60.43,15.1 v60.48,15.24 | 60.03,15.24 60.43,15.38 v60.48,15.24 | 79.7,21.44 79.31,21.25 v79.38,21.11 | 79.7,21.44 79.51,21.05 v79.38,21.11 | 50.64,23.47 50.66,23.97 v50.48,23.97 | 50.64,23.47 50.34,23.87 v50.48,23.97 | 13.86,18.26 13.39,18.42 v13.34,18.26 | 13.86,18.26 13.39,18.09 v13.34,18.26 | 16.17,18.26 16.66,18.24 v16.67,18.41 | 16.17,18.26 16.56,18.55 v16.67,18.41
DIO1  (via drill 0.3)
  Top 0.305: IC1.14 65.54,53.2 63.5,55.24 61.16,55.24 61.1,55.19 60.38,55.19 59.69,55.88 58.88,55.88 | 57.96,55.88 57.14,55.88 52.56,51.31 52.56,47.48 47.65,42.57 47.65,40.7 48.46,39.89 48.46,33.5 | 57.96,55.88 v58.42,55.88 | v48.46,33.04 48.46,33.5 | 58.88,55.88 v58.42,55.88 | v79.06,59.69 79.52,59.69 | 79.52,59.69 83.66,59.69 84.3,59.05 84.3,58.74 | 84.3,58.74 IC4.RESET | SV1.5 51.35,20.87 | 51.35,20.87 49.53,19.05 STM-R1.1 49.02,16.86 48.7,16.86 | 48.7,16.86 RESET-STM.3 | RESET-STM.4 40.49,17.56 | 40.49,17.56 40.27,17.78 15.24,17.78 13.3,19.72 DIO1-JP.1 | 48.46,33.5 48.32,33.1 v48.46,33.04 | 48.46,33.5 48.6,33.1 v48.46,33.04 | 57.96,55.88 58.37,55.74 v58.42,55.88 | 57.96,55.88 58.37,56.02 v58.42,55.88 | 58.88,55.88 58.47,56.02 v58.42,55.88 | 58.88,55.88 58.47,55.74 v58.42,55.88 | 79.52,59.69 79.11,59.83 v79.06,59.69 | 79.52,59.69 79.11,59.55 v79.06,59.69 | 48.7,16.86 48.06,17.33 RESET-STM.3 | 48.7,16.86 48.06,16.38 RESET-STM.3 | 40.49,17.56 40.61,16.77 RESET-STM.4 | 40.49,17.56 41.29,17.45 RESET-STM.4 | 51.35,20.87 52.16,20.99 SV1.5 | 51.35,20.87 51.47,21.68 SV1.5 | 84.3,58.74 83.92,58.19 IC4.RESET | 84.3,58.74 84.67,58.19 IC4.RESET
  Bottom 0.305: v58.42,55.88 58.74,56.2 | 58.74,56.2 61.91,59.37 62.55,59.37 63.18,60.01 63.18,60.96 63.82,61.59 69.85,61.59 71.75,59.69 78.6,59.69 | 78.6,59.69 v79.06,59.69 | v48.46,33.04 48.46,32.59 | 48.46,32.59 48.46,28.06 50.64,25.88 53.34,25.88 53.98,25.24 53.98,21.91 53.66,21.59 53.09,21.59 | 53.09,21.59 SV1.5 | RESET-STM.4 42.2,16.86 | 42.2,16.86 46.7,16.86 | 46.7,16.86 RESET-STM.3 | 48.46,32.59 48.6,32.99 v48.46,33.04 | 48.46,32.59 48.32,32.99 v48.46,33.04 | 58.74,56.2 58.35,56.02 v58.42,55.88 | 58.74,56.2 58.56,55.81 v58.42,55.88 | 78.6,59.69 79.01,59.55 v79.06,59.69 | 78.6,59.69 79.01,59.83 v79.06,59.69 | 46.7,16.86 47.34,16.38 RESET-STM.3 | 46.7,16.86 47.34,17.33 RESET-STM.3 | 42.2,16.86 41.56,17.33 RESET-STM.4 | 42.2,16.86 41.56,16.38 RESET-STM.4 | 53.09,21.59 52.44,22.08 SV1.5 | 53.09,21.59 52.44,21.1 SV1.5
DOUT
  Top 0.305: IC1.90 85.77,45.45 88.27,47.94 89.1,47.94 | 89.1,47.94 TO-UNDER.4 | 89.1,47.94 89.7,47.51 TO-UNDER.4 | 89.1,47.94 89.7,48.38 TO-UNDER.4
DP1  (via drill 0.35)
  Top 0.305: 85.57,25.51 85.57,26.83 82.71,29.69 69.8,29.69 69.14,30.35 | 85.57,25.51 85.57,25.4 85.25,25.08 LED1.5 | IC1.69 69.04,35.51 | 69.04,35.51 69.04,35.27 v68.8,35.04 | v68.77,30.72 69.14,30.35 | 69.04,35.51 68.68,35.16 v68.8,35.04 | 69.04,35.51 68.98,35.02 v68.8,35.04 | 69.14,30.35 68.92,30.8 v68.77,30.72 | 69.14,30.35 68.69,30.57 v68.77,30.72 | 85.57,25.51 84.84,25.6 LED1.5 | 85.57,25.51 85.24,24.85 LED1.5
  Bottom 0.305: v68.8,35.04 68.63,34.86 68.63,34.54 | 68.63,34.54 68.63,32.34 68.75,32.21 68.75,31.25 | 68.75,31.25 68.75,30.74 v68.77,30.72 68.93,30.79 68.75,31.25 | 68.63,34.54 68.94,34.93 v68.8,35.04 | 68.63,34.54 68.63,35.04 v68.8,35.04
DP2  (via drill 0.35)
  Top 0.305: 83.87,11.91 83.66,11.91 82.39,13.18 82.39,17.62 83.34,18.57 85.41,18.57 86.02,19.19 86.02,27.02 82.9,30.14 70.48,30.14 70,30.63 | 83.87,11.91 LED2.5 | IC1.70 69.54,35.2 | 69.54,35.2 69.54,34.81 v69.66,34.69 | v69.62,31 70,30.63 | 69.54,35.2 69.49,34.71 v69.66,34.69 | 69.54,35.2 69.81,34.79 v69.66,34.69 | 70,30.63 69.78,31.08 v69.62,31 | 70,30.63 69.55,30.85 v69.62,31 | 83.87,11.91 84.47,11.48 LED2.5 | 83.87,11.91 84.47,12.33 LED2.5
  Bottom 0.305: v69.66,34.69 69.29,34.32 | 69.29,34.32 69.22,34.24 69.22,31.41 69.25,31.38 | 69.25,31.38 v69.62,31 | 69.29,34.32 69.74,34.53 v69.66,34.69 | 69.29,34.32 69.5,34.77 v69.66,34.69 | 69.25,31.38 69.47,30.93 v69.62,31 | 69.25,31.38 69.7,31.16 v69.62,31
E1  (via drill 0.3)
  Top 0.305: v54.29,49.21 54.62,48.89 | 54.62,48.89 57.55,45.95 IC1.35 | 54.62,48.89 54.43,49.28 v54.29,49.21 | 54.62,48.89 54.23,49.07 v54.29,49.21
  Bottom 0.305: 27.48,62.23 30.8,62.23 33.02,60.01 33.02,57.15 35.56,54.61 38.1,54.61 38.73,53.97 38.73,53.02 39.69,52.07 51.44,52.07 53.97,49.54 | 27.48,62.23 L3.A | v54.29,49.21 53.97,49.54 | 53.97,49.54 54.16,49.15 v54.29,49.21 | 53.97,49.54 54.36,49.35 v54.29,49.21 | 27.48,62.23 26.93,62.61 L3.A | 27.48,62.23 26.93,61.85 L3.A
E2  (via drill 0.3)
  Top 0.305: IC1.36 56.47,45.45 54.62,47.3 | 54.62,47.3 v54.29,47.62 | 54.62,47.3 54.43,47.69 v54.29,47.62 | 54.62,47.3 54.23,47.49 v54.29,47.62
  Bottom 0.305: L4.A 27.25,54.03 | 27.25,54.03 31.75,49.53 37.78,49.53 38.73,50.48 51.44,50.48 53.97,47.95 | 53.97,47.95 v54.29,47.62 | 53.97,47.95 54.16,47.56 v54.29,47.62 | 53.97,47.95 54.36,47.76 v54.29,47.62 | 27.25,54.03 27.12,54.7 L4.A | 27.25,54.03 26.59,54.16 L4.A
FET1  (via drill 0.3)
  Top 0.305: 77.61,55.24 78.11,55.24 78.74,54.61 78.74,51.11 75.58,47.95 IC1.95 | 77.61,55.24 77.15,55.24 v77.15,55.27 | v76.52,57.47 76.52,57.92 | 76.52,57.92 76.52,79.38 74.61,81.28 69.22,81.28 66.66,83.83 FET1-R1.2 | 77.61,55.24 77.21,55.41 v77.15,55.27 | 77.61,55.24 77.19,55.12 v77.15,55.27 | 76.52,57.92 76.37,57.52 v76.52,57.47 | 76.52,57.92 76.66,57.52 v76.52,57.47
  Bottom 0.305: v77.15,55.27 76.83,55.59 | 76.83,55.59 76.52,55.9 76.52,57.01 | 76.52,57.01 v76.52,57.47 | 76.83,55.59 77.02,55.2 v77.15,55.27 | 76.83,55.59 77.22,55.41 v77.15,55.27 | 76.52,57.01 76.66,57.42 v76.52,57.47 | 76.52,57.01 76.37,57.42 v76.52,57.47
FET2  (via drill 0.3)
  Top 0.305: IC1.96 75.44,48.45 77.79,50.8 77.79,54.15 | 77.79,54.15 v77.79,54.61 | v77.79,57.47 77.79,57.92 | 77.79,57.92 77.79,81.6 86.51,90.32 FET2-R1.2 | 77.79,54.15 77.93,54.56 v77.79,54.61 | 77.79,54.15 77.64,54.56 v77.79,54.61 | 77.79,57.92 77.64,57.52 v77.79,57.47 | 77.79,57.92 77.93,57.52 v77.79,57.47
  Bottom 0.305: v77.79,54.61 77.79,55.07 | 77.79,55.07 77.79,57.01 | 77.79,57.01 v77.79,57.47 | 77.79,55.07 77.64,54.66 v77.79,54.61 | 77.79,55.07 77.93,54.66 v77.79,54.61 | 77.79,57.01 77.93,57.42 v77.79,57.47 | 77.79,57.01 77.64,57.42 v77.79,57.47
FLED-BLUE  (via drill 0.3)
  Top 0.305: IC1.7 69.04,50.88 | 69.04,50.88 69.04,50.77 69.07,50.73 69.07,50.69 v69.28,50.48 | v59.69,44.45 60.01,44.77 | 60.01,44.77 60.33,45.08 64.37,45.08 67.84,48.55 68.06,48.55 68.35,48.84 | v68.62,49.21 68.5,49.21 68.42,49.13 68.42,48.91 68.35,48.84 | 69.04,50.88 69.13,50.45 v69.28,50.48 | 69.04,50.88 69.37,50.6 v69.28,50.48 | 68.35,48.84 68.7,49.09 v68.62,49.21 | 68.35,48.84 68.47,49.26 v68.62,49.21 | 60.01,44.77 59.62,44.59 v59.69,44.45 | 60.01,44.77 59.83,44.38 v59.69,44.45
  Bottom 0.305: 68.62,49.67 68.62,49.82 68.67,49.87 68.72,49.87 68.98,50.13 | 68.62,49.67 v68.62,49.21 | 68.98,50.13 69.07,50.23 69.07,50.28 v69.28,50.48 69.35,50.35 68.98,50.13 | v59.69,44.45 59.23,44.45 | 59.23,44.45 45.3,44.45 R-B.1 | 68.62,49.67 68.47,49.26 v68.62,49.21 | 68.62,49.67 68.76,49.26 v68.62,49.21 | 59.23,44.45 59.64,44.31 v59.69,44.45 | 59.23,44.45 59.64,44.59 v59.69,44.45
FLED-GREEN  (via drill 0.3)
  Top 0.305: IC1.8 68.54,50.93 | 68.54,50.93 68.54,50.56 v68.46,50.48 | 60.15,45.72 64.36,45.72 v67.81,49.16 | 60.15,45.72 v59.69,45.72 | 68.54,50.93 68.33,50.56 v68.46,50.48 | 68.54,50.93 68.61,50.51 v68.46,50.48 | 60.15,45.72 59.74,45.86 v59.69,45.72 | 60.15,45.72 59.74,45.58 v59.69,45.72
  Bottom 0.305: 68.17,50.13 68.26,50.23 68.26,50.28 v68.46,50.48 68.54,50.35 68.17,50.13 | 68.17,50.13 67.77,49.74 67.77,49.62 | 67.77,49.62 67.77,49.2 v67.81,49.16 67.94,49.23 67.77,49.62 | v59.69,45.72 59.23,45.72 | 59.23,45.72 R-G.1 | 59.23,45.72 59.64,45.58 v59.69,45.72 | 59.23,45.72 59.64,45.86 v59.69,45.72
FLED-RED  (via drill 0.3)
  Top 0.305: v66.99,49.21 66.67,48.89 | 66.67,48.89 64.66,46.88 60.15,46.88 | 60.15,46.88 v59.69,46.88 | v67.65,50.48 67.65,50.94 | 67.65,50.94 67.65,51.13 68.04,51.52 IC1.9 | 66.67,48.89 67.06,49.07 v66.99,49.21 | 66.67,48.89 66.86,49.28 v66.99,49.21 | 60.15,46.88 59.74,47.03 v59.69,46.88 | 60.15,46.88 59.74,46.74 v59.69,46.88 | 67.65,50.94 67.51,50.53 v67.65,50.48 | 67.65,50.94 67.79,50.53 v67.65,50.48
  Bottom 0.305: v67.65,50.48 67.33,50.16 | 67.33,50.16 67.31,50.14 67.31,49.54 | 67.31,49.54 67.31,49.53 v66.99,49.21 66.92,49.35 67.31,49.54 | v59.69,46.88 59.23,46.88 | 59.23,46.88 45.41,46.88 R-R.1 | 59.23,46.88 59.64,46.74 v59.69,46.88 | 59.23,46.88 59.64,47.03 v59.69,46.88 | 67.33,50.16 67.72,50.34 v67.65,50.48 | 67.33,50.16 67.51,50.55 v67.65,50.48
GATE
  Top 0.305: IC1.89 85.92,44.95 87.64,46.67 91.92,46.67 92.31,46.28 | 92.31,46.28 92.55,46.04 TO-UNDER.5 | 92.31,46.28 92.05,45.59 TO-UNDER.5 | 92.31,46.28 92.89,45.82 TO-UNDER.5
GND  (via drill 0.3, 0.35, 0.6, 0.9, 1)
  Top 0.152: GND-CH.1 24.61,30.43 | 24.61,30.43 v24.61,30.96 | 24.61,30.43 24.83,30.84 v24.61,30.96 | 24.61,30.43 24.39,30.84 v24.61,30.96
  Top 0.305: STM-C3.1 57.61,34.92 | 57.61,34.92 v57.15,34.92 | IC1.27 57.59,49.95 | 57.59,49.95 57.26,49.95 v57.15,49.84 | IC1.10 v67.54,53.1 v67.55,53.1 | U2.4 68.58,64.31 | 68.58,64.31 v68.58,64.77 | C6.1 66.22,60.32 | 66.22,60.32 v66.67,60.32 | v66.67,60.32 67.13,60.32 | 67.13,60.32 C5.1 | IC1.20 62.54,53.03 62.03,53.53 | v61.59,53.66 61.91,53.66 62.03,53.53 | S1.2 37.42,9.72 | 37.42,9.72 v37.94,9.72 | v37.94,9.72 38.47,9.72 | 38.47,9.72 S1.1 | IC1.74 71.54,37.73 71.75,37.94 73.39,37.94 | 73.39,37.94 73.66,37.94 v73.82,37.78 | STM-C4.1 78.1,37.76 | 78.1,37.76 v78.1,37.31 | v78.1,37.31 78.1,36.85 | 78.1,36.85 STM-C5.2 | v59.37,53.82 59.53,53.66 59.8,53.66 | 59.8,53.66 61.14,53.66 | 61.14,53.66 v61.59,53.66 | IC1.99 72.81,49.95 72.39,49.53 72.39,49.26 | 72.39,49.26 v72.39,48.74 | 57.61,34.92 57.2,35.07 v57.15,34.92 | 57.61,34.92 57.2,34.78 v57.15,34.92 | 57.59,49.95 57.16,49.99 v57.15,49.84 | 57.59,49.95 57.23,49.71 v57.15,49.84 | 68.58,64.31 68.72,64.72 v68.58,64.77 | 68.58,64.31 68.44,64.72 v68.58,64.77 | 62.03,53.53 61.68,53.78 v61.59,53.66 | 62.03,53.53 61.6,53.5 v61.59,53.66 | 61.14,53.66 61.54,53.51 v61.59,53.66 | 61.14,53.66 61.54,53.8 v61.59,53.66 | 66.22,60.32 66.62,60.18 v66.67,60.32 | 66.22,60.32 66.62,60.47 v66.67,60.32 | 67.13,60.32 66.73,60.47 v66.67,60.32 | 67.13,60.32 66.73,60.18 v66.67,60.32 | 37.42,9.72 37.88,9.55 v37.94,9.72 | 37.42,9.72 37.88,9.88 v37.94,9.72 | 38.47,9.72 38,9.88 v37.94,9.72 | 38.47,9.72 38,9.55 v37.94,9.72 | 73.39,37.94 73.72,37.66 v73.82,37.78 | 73.39,37.94 73.82,37.93 v73.82,37.78 | 78.1,37.76 77.96,37.36 v78.1,37.31 | 78.1,37.76 78.25,37.36 v78.1,37.31 | 78.1,36.85 78.25,37.25 v78.1,37.31 | 78.1,36.85 77.96,37.25 v78.1,37.31
  Top 0.305: 59.8,53.66 59.47,53.93 v59.37,53.82 | 59.8,53.66 59.37,53.66 v59.37,53.82 | 72.39,49.26 72.22,48.79 v72.39,48.74 | 72.39,49.26 72.56,48.79 v72.39,48.74
  Top 0.61: v93.98,57.15 v93.98,54.61 v93.98,52.07 v93.98,49.53 v93.98,46.99 v93.98,44.45 v93.98,41.91 v93.98,39.37 v93.98,36.83 v93.98,34.29 v93.98,32.54 v93.98,30.8 v93.98,28.89 v93.98,26.99 | v95.66,57.15 v95.66,54.61 v95.66,52.07 v95.66,49.53 v95.66,46.99 v95.66,44.45 v95.66,41.91 v95.66,39.37 v95.66,36.83 v95.66,34.29 v95.66,32.54 v95.66,30.8 v95.66,28.89 v95.66,26.99 v95.66,25.88 | v62.23,20.16 60.8,20.16 v60.33,19.68 | STM-C1.1 55.7,51.74 54.99,51.74 54.6,51.35 54.6,51.33 v54.59,51.32
  Top 1.016: 5VREG.7 v48.65,91.7 v48.64,91.69 | SP-SW2.4 SP-SW2.3 33.51,68.58 v33.02,68.58 | C1.2 37.49,81.46 v37.44,81.41 | R1.2 53.07,82.32 SL-R1.1
  Top 1.27: X2.2 14.03,92.84 v19.43,92.84 3.3REG.3 | 5VREG.3 41.4,92.71 v43.18,92.71 | 3.3REG.7 v29.6,91.7 v29.59,91.69 | C2.2 41.4,83.65 40.53,83.65 39.47,82.59 | C1.2 37.64,82.59 39.47,82.59 | 5C2.2 39.5,82.59 39.47,82.59 | C4.2 26.42,83.43 v26.94,83.43 | C3.2 22.99,82.14 v23.01,82.17 | 5C1.- 51,78.4 R1.2
  Top 1.524: 9C1.- 22.84,68.87 VOLTAGE-METER1.P$2 | 3.3C2.2 30.51,76.59 3.3C1.-
  other vias: 74.93,54.29 61.77,83.83 30.85,76.93 22.08,76.84 88.44,90.66 49.69,22.33 63.34,41.59 68.26,40.96 71.12,45.72 66.52,43.34 68.9,45.72 70.01,45.72 72.23,45.72 72.39,47.78 68.26,40 69.37,40 65.25,40 64.14,40 63.02,40 61.91,40 64.45,41.59 65.56,41.59 64.45,42.39 67.15,42.54 65.72,44.13 70.01,44.77 71.12,44.77 72.23,44.77 72.23,43.66 71.28,47.78 70.17,47.78 69.06,47.78 71.28,48.74 70.17,48.74 72.55,37.78 32.54,6.19 32.54,7.46 31.27,6.19 31.27,7.46 4.13,17.78 5.4,16.51 4.13,16.51 2.86,17.78 1.59,17.78 2.86,16.51 1.59,16.51 2.86,15.24 1.59,15.24 2.86,13.97 1.59,13.97 5.4,15.24 4.13,15.24 5.4,13.97 4.13,13.97 5.4,12.7 4.13,12.7 5.4,11.43 4.13,11.43 2.86,12.7 1.59,12.7 2.86,11.43 1.59,11.43 2.86,10.16 1.59,10.16 2.86,8.89 1.59,8.89 5.4,10.16 4.13,10.16 5.4,8.89 4.13,8.89 9.53,6.51 10.79,6.51 9.53,7.78 10.79,7.78 9.53,5.24 12.06,7.78 13.34,7.78 12.06,9.05 13.34,9.05 12.06,10.32 13.34,10.32 9.53,9.05 10.79,9.05 9.53,10.32 10.79,10.32 9.53,11.59 10.79,11.59 9.53,12.86 10.79,12.86 12.06,11.59 27.46,6.19 27.46,7.46 26.19,6.19 26.19,7.46 30,6.19 30,7.46 28.73,6.19 28.73,7.46 32.54,8.73 32.54,10 31.27,8.73 31.27,10 30,8.73 30,10 28.73,8.73 28.73,10 27.46,8.73 27.46,10 26.19,8.73 26.19,10 24.92,8.73 24.92,10 23.65,8.73 23.65,10 24.92,6.19 24.92,7.46 23.65,6.19 23.65,7.46 20,12.86 20,14.13 18.73,12.86 18.73,14.13 17.46,12.86 17.46,14.13 16.19,12.86 16.19,14.13 14.92,12.86 14.92,14.13 13.65,12.86 13.65,14.13 12.38,14.13 12.38,15.4 12.38,16.67 11.11,15.4 11.11,16.67 14.92,15.4 14.92,16.67 13.65,15.4 13.65,16.67 17.46,15.4 17.46,16.67 16.19,15.4 16.19,16.67 20,15.4 20,16.67 18.73,15.4 18.73,16.67 12.38,21.91 14.92,20.64 13.65,20.64 17.46,19.37 16.19,19.37 20,19.37 18.73,19.37 22.54,19.37 21.27,19.37 25.08,19.37 23.81,19.37 26.35,19.37 30.16,19.37 14.92,19.37 12.38,20.64 14.92,21.91 13.65,21.91 17.46,21.91 16.19,21.91 17.46,20.64 16.19,20.64 20,20.64 18.73,20.64 18.73,21.91 31.43,19.37 32.7,19.37 23.65,12.86 24.92,12.86 26.19,12.86 27.46,12.86 28.73,12.86 30,12.86 30,14.13 28.73,14.13 27.46,14.13 26.19,14.13 24.92,14.13 26.19,15.4 27.46,15.4 28.73,15.4 30,15.4 27.46,16.67 28.73,16.67 30,16.67 31.27,16.67 22.38,6.19 22.38,7.46 21.11,6.19 21.11,7.46 22.38,8.73 14.92,11.59 16.19,11.59 17.46,11.59 18.73,11.59 17.46,10.32 16.35,10.32 21.11,10 19.84,10 19.84,8.73 18.57,8.73 21.11,11.27 22.38,11.27 22.38,12.54 14.61,7.78 14.61,9.05 10.79,3.18 12.06,4.29 13.34,5.56 17.3,6.19 16.03,6.19 16.03,4.92 14.76,4.92 14.76,3.65 13.49,3.65 32.54,2.7 32.54,3.97 31.27,2.7 31.27,3.97 27.46,2.7 27.46,3.97 26.19,2.7 26.19,3.97 30,2.7 30,3.97 28.73,2.7 28.73,3.97 24.92,3.97 23.65,3.97 22.38,2.7 22.38,3.97 21.11,3.97 32.54,1.43 31.27,1.43 30,1.43 28.73,1.43 27.46,1.43 19.84,3.97 18.57,3.97 18.57,2.7 6.67,8.89 6.67,10.16 6.67,11.43 6.67,12.7 6.67,13.97 6.67,15.24 2.86,19.05 4.13,19.05 4.92,21.43 9.84,16.67 8.57,17.94 21.27,16.67 21.27,15.4 22.54,16.67 22.54,15.56 21.27,14.13 23.81,16.67 28.89,22.86 27.62,22.86 30.16,22.86 27.62,24.13 28.89,24.13 30.16,24.13 31.43,24.13 26.35,22.86 32.7,22.86 32.86,15.4 32.86,14.13 32.86,12.86
  pour Bottom: -1.27,99.06 99.06,99.06 99.06,0 -1.27,0
  pour Top: 59.05,51.43 73.03,51.43 73.03,37.46 59.05,37.46
  pour Top: 34.13,24.61 34.13,0.64 7.3,0.64 1.11,6.83 1.11,18.41 7.3,24.61
LCD-CS  (via drill 0.3)
  Top 0.305: IC1.53 61.04,35.71 60.82,35.49 60.82,34.99 61.08,34.73 | 61.08,34.73 v61.4,34.41 | SPI-LCD.3 63.98,19.05 65.54,20.61 65.54,28.63 | v65.54,29.08 65.54,28.63 | 61.08,34.73 61.26,34.35 v61.4,34.41 | 61.08,34.73 61.47,34.55 v61.4,34.41 | 65.54,28.63 65.68,29.03 v65.54,29.08 | 65.54,28.63 65.4,29.03 v65.54,29.08
  Bottom 0.305: v61.4,34.41 61.72,34.09 | 61.72,34.09 65.54,30.27 65.54,29.54 | 65.54,29.54 v65.54,29.08 | 61.72,34.09 61.54,34.48 v61.4,34.41 | 61.72,34.09 61.33,34.27 v61.4,34.41 | 65.54,29.54 65.4,29.13 v65.54,29.08 | 65.54,29.54 65.68,29.13 v65.54,29.08
LCD-RST  (via drill 0.3)
  Top 0.305: IC1.54 61.54,35.69 | 61.54,35.69 61.54,35.35 v61.43,35.24 61.58,35.26 61.54,35.69 | SPI-LCD.4 65.09,16.51 66.15,17.57 66.15,30.02 | v66.15,30.48 66.15,30.02 | 66.15,30.02 66.29,30.43 v66.15,30.48 | 66.15,30.02 66.01,30.43 v66.15,30.48
  Bottom 0.305: v61.43,35.24 61.75,34.92 | 61.75,34.92 65.85,30.82 | 65.85,30.82 66.15,30.52 v66.15,30.48 | 61.75,34.92 61.57,35.31 v61.43,35.24 | 61.75,34.92 61.37,35.1 v61.43,35.24 | 65.85,30.82 66.01,30.42 v66.15,30.48 | 65.85,30.82 66.22,30.61 v66.15,30.48
LED-RST  (via drill 0.35)
  Top 0.305: LED1.2 85.09,17.46 85.55,17.92 | 85.55,17.92 86.48,18.85 86.48,27.21 83.09,30.6 71.24,30.6 70.58,31.26 | IC1.71 70.04,35.91 | 70.04,35.91 70.04,35.53 v70.17,35.4 | v70.21,31.63 70.58,31.26 | 70.04,35.91 70,35.42 v70.17,35.4 | 70.04,35.91 70.32,35.5 v70.17,35.4 | 70.58,31.26 70.37,31.71 v70.21,31.63 | 70.58,31.26 70.13,31.47 v70.21,31.63 | 85.55,17.92 84.82,17.98 LED1.2 | 85.55,17.92 85.25,17.25 LED1.2
  Top 0.813: LED2.2 88.57,8.09 S3.2 | S3.2 S3.1 | LED1.2 83.34,16.03 83.34,14.13 84.14,13.34 86.04,13.34 86.68,12.7 86.68,11.59 87.91,10.36 S3.2
  Bottom 0.305: v70.21,31.63 70.17,31.67 70.17,32.16 | v70.17,35.4 70.17,35.07 70.3,34.95 70.3,34.89 | 70.3,34.89 70.3,34.43 70.17,34.31 70.17,32.16 | 70.3,34.89 70.35,35.38 v70.17,35.4 | 70.3,34.89 70.03,35.31 v70.17,35.4 | 70.17,32.16 70.04,31.68 v70.21,31.63 | 70.17,32.16 70.37,31.7 v70.21,31.63
M1CS
  Top 0.305: IC1.41 53.78,42.95 50.9,40.07 50.9,35.46 53.96,32.4 | 53.96,32.4 MOTORDRIVER.6 54.08,31.66 53.96,32.4
M1EN
  Top 0.305: 49.53,32.66 MOTORDRIVER.10 49.96,32.06 49.53,32.66 | 49.53,32.66 49.53,40.64 53.34,44.45 IC1.38
M1INA
  Top 0.305: MOTORDRIVER.9 49.53,30.12 | 49.53,30.12 49.53,30.35 48.54,31.34 48.54,32.16 49.07,32.69 49.07,40.83 53.19,44.95 IC1.37 | 49.53,30.12 49.1,29.52 MOTORDRIVER.9 | 49.53,30.12 49.96,29.52 MOTORDRIVER.9
M1INB
  Top 0.305: MOTORDRIVER.8 51.42,32.4 | 51.42,32.4 49.99,33.83 49.99,40.45 53.49,43.95 IC1.39 | 51.42,32.4 51.54,31.66 MOTORDRIVER.8 | 51.42,32.4 52.16,32.28 MOTORDRIVER.8
M1PWM
  Top 0.305: MOTORDRIVER.7 52.72,29.86 | 52.72,29.86 53.06,30.2 53.06,32.35 50.44,34.96 50.44,40.26 53.63,43.45 IC1.40 | 52.72,29.86 51.98,29.74 MOTORDRIVER.7 | 52.72,29.86 52.6,29.12 MOTORDRIVER.7
M2CS
  Top 0.305: MOTORDRIVER.1 59.69,30.12 | 59.69,30.12 59.69,30.35 60.68,31.34 60.68,32.16 60.1,32.74 58.21,32.74 57.75,33.2 57.15,33.2 55.78,34.57 55.02,34.57 53.19,36.4 53.19,39.12 54.51,40.45 IC1.46 | 59.69,30.12 59.26,29.52 MOTORDRIVER.1 | 59.69,30.12 60.12,29.52 MOTORDRIVER.1
M2EN
  Top 0.305: MOTORDRIVER.5 54.61,29.7 54.96,30.05 | 54.96,30.05 56.06,31.15 56.06,32.35 55.21,33.2 54.45,33.2 51.82,35.84 51.82,39.69 54.07,41.95 IC1.43 | 54.96,30.05 54.33,29.66 MOTORDRIVER.5 | 54.96,30.05 55.13,29.33 MOTORDRIVER.5
M2INA
  Top 0.305: 56.52,32.41 56.52,32.38 MOTORDRIVER.4 56.62,31.67 56.52,32.41 | 56.52,32.41 56.52,32.54 55.4,33.65 54.65,33.65 52.27,36.03 52.27,39.5 54.22,41.45 IC1.44
M2INB
  Top 0.305: MOTORDRIVER.3 57.8,29.86 | 57.8,29.86 57.96,30.02 57.96,31.16 58.14,31.34 58.14,32.16 57.56,32.74 56.96,32.74 55.59,34.11 54.83,34.11 52.73,36.22 52.73,39.31 54.37,40.95 IC1.45 | 57.8,29.86 57.06,29.74 MOTORDRIVER.3 | 57.8,29.86 57.68,29.12 MOTORDRIVER.3
M2PWM
  Top 0.305: MOTORDRIVER.2 59.04,31.1 | 59.04,31.1 58.42,30.48 58.42,28.26 58.1,27.94 53.98,27.94 53.34,28.57 53.34,29.83 53.52,30.01 53.52,30.02 54.25,30.76 55.02,30.76 55.6,31.34 55.6,32.16 55.02,32.74 54.27,32.74 51.36,35.65 51.36,39.88 53.93,42.45 IC1.42 | 59.04,31.1 59.78,31.22 MOTORDRIVER.2 | 59.04,31.1 59.16,31.84 MOTORDRIVER.2
MISOD  (via drill 0.3)
  Top 0.305: IC1.17 64.04,50.96 64.17,50.83 | 64.17,50.83 64.26,50.74 64.26,50.69 v64.46,50.48 64.54,50.61 64.17,50.83
  Bottom 0.305: v64.46,50.48 64.46,50.02 | 64.46,50.02 64.46,49.76 65.04,49.18 65.04,48.55 65.34,48.26 65.34,48.04 73.56,39.83 81.79,39.83 87.64,33.97 91.92,33.97 92.31,33.58 | 92.31,33.58 92.55,33.34 TO-UNDER.15 | 64.46,50.02 64.61,50.43 v64.46,50.48 | 64.46,50.02 64.32,50.43 v64.46,50.48 | 92.31,33.58 92.05,32.89 TO-UNDER.15 | 92.31,33.58 92.89,33.12 TO-UNDER.15
MISOF  (via drill 0.3)
  Top 0.305: IC1.31 61.52,47.95 61.64,48.07 | 61.64,48.07 v61.96,48.39 v61.96,48.4 | 71.54,66.46 71.44,66.36 68.59,66.36 67.32,65.09 66.67,65.09 66.04,64.45 | 71.54,66.46 SPI-R.P$4 71.65,67.39 71.54,66.46 | v61.96,48.4 62.42,48.4 | 62.42,48.4 63.04,48.4 63.49,47.95 | 63.49,47.95 v63.82,47.62 | 61.6,57.47 v61.92,57.15 61.98,57.29 61.6,57.47 | 61.6,57.47 61.59,57.47 61.59,64.45 62.23,65.09 65.41,65.09 66.04,64.45 | 66.04,64.45 U2.2 | 61.64,48.07 62.03,48.26 v61.96,48.4 | 61.64,48.07 61.82,48.46 v61.96,48.4 | 62.42,48.4 62.01,48.54 v61.96,48.4 | 62.42,48.4 62.01,48.26 v61.96,48.4 | 63.49,47.95 63.68,47.56 v63.82,47.62 | 63.49,47.95 63.88,47.76 v63.82,47.62
  Bottom 0.305: 62.29,48.72 62.17,48.6 62.16,48.6 v61.96,48.4 62.1,48.33 62.29,48.72 | 62.29,48.72 62.53,48.96 62.53,49.46 62.37,49.63 62.37,54.16 61.92,54.61 61.92,56.69 | v61.92,57.15 61.92,56.69 | SPI-LCD.9 62.23,3.81 61.75,4.29 61.75,9.05 62.55,9.84 64.93,9.84 67.31,12.22 67.31,25.89 71.3,29.88 71.3,40.14 v63.82,47.62 | 61.92,56.69 62.06,57.1 v61.92,57.15 | 61.92,56.69 61.77,57.1 v61.92,57.15
MOSID  (via drill 0.3)
  Top 0.305: IC1.18 63.54,50.93 | 63.54,50.93 63.54,50.6 v63.65,50.49 63.5,50.5 63.54,50.93
  Bottom 0.305: v63.65,50.49 63.85,50.29 63.85,50.08 | 63.85,50.08 63.85,49.72 64.59,48.99 64.59,48.36 64.88,48.07 64.88,47.85 73.37,39.37 81.6,39.37 88.27,32.7 89.1,32.7 | 89.1,32.7 TO-UNDER.16 | 63.85,50.08 63.8,50.51 v63.65,50.49 | 63.85,50.08 63.54,50.38 v63.65,50.49 | 89.1,32.7 89.7,32.27 TO-UNDER.16 | 89.1,32.7 89.7,33.14 TO-UNDER.16
MOSIF  (via drill 0.3)
  Top 0.305: IC1.32 59.32,47.45 59.36,47.49 61.47,47.49 | 71.19,69.85 69.22,69.85 68.58,69.22 U2.5 68.58,66.99 67.13,65.55 62.04,65.55 61.14,64.64 61.14,57.28 61.31,57.11 61.31,56.48 61.94,56.48 62.22,56.2 | 71.19,69.85 SPI-R.P$3 | 61.47,47.49 v61.93,47.49 61.88,47.35 61.47,47.49 | 62.22,56.2 v62.55,55.88 | 62.22,56.2 62.41,55.81 v62.55,55.88 | 62.22,56.2 62.61,56.02 v62.55,55.88 | 71.19,69.85 71.92,69.27 SPI-R.P$3 | 71.19,69.85 71.92,70.44 SPI-R.P$3
  Bottom 0.305: v61.93,47.49 62.25,47.82 | 62.25,47.82 62.99,48.55 62.99,49.65 62.83,49.82 62.83,54.35 62.55,54.63 62.55,55.42 | v62.55,55.88 62.55,55.42 | v61.93,47.49 62.38,47.49 | 62.38,47.49 63.09,47.49 63.56,47.01 63.78,47.01 70.84,39.95 70.84,30.07 66.18,25.4 62.23,25.4 61.12,24.29 61.12,12.22 61.91,11.43 SPI-LCD.6 | 62.25,47.82 62.06,47.43 v61.93,47.49 | 62.38,47.49 61.98,47.64 v61.93,47.49 | 62.38,47.49 61.98,47.35 v61.93,47.49 | 62.55,55.42 62.69,55.83 v62.55,55.88 | 62.55,55.42 62.4,55.83 v62.55,55.88
MR1A  (via drill 0.3, 0.35)
  Top 0.305: IC1.23 61.04,51.51 | 61.04,51.51 61.04,51.35 v61.28,51.12 61.13,51.09 61.04,51.51 | CON1.P$2 75.88,33.97 75.53,34.33 | 75.53,34.33 75.44,34.41 72.39,34.41 70.69,32.72 67.84,32.72 | 67.84,32.72 67.51,32.72 v67.34,32.89 67.34,32.71 67.84,32.72 | 75.53,34.33 75.19,33.45 CON1.P$2 | 75.53,34.33 76.3,33.8 CON1.P$2
  Bottom 0.305: 61.31,50.66 61.31,50.79 61.28,50.83 v61.28,51.12 61.42,51.08 61.31,50.66 | 61.31,50.66 61.31,47.24 61.67,46.88 61.88,46.88 67.34,41.42 67.34,33.41 | 67.34,33.41 v67.34,32.89 67.5,32.95 67.34,33.41
MR1B  (via drill 0.3, 0.35)
  Top 0.305: IC1.24 60.54,50.97 | 60.54,50.97 60.54,50.71 v60.7,50.54 | CON1.P$1 72.14,33.18 | 60.54,50.97 60.55,50.54 v60.7,50.54 | 60.54,50.97 60.82,50.64 v60.7,50.54 | 67.93,32.26 67.44,32.21 v67.46,32.03 67.58,31.91 67.93,32.26 | 72.14,33.18 72.88,32.59 CON1.P$1 | 72.14,33.18 72.88,33.76 CON1.P$1 | 72.14,33.18 71.23,32.26 67.93,32.26
  Bottom 0.305: 60.85,50.39 v60.7,50.54 | 60.85,50.11 60.85,47.05 61.48,46.43 61.69,46.43 66.88,41.23 66.88,33.33 66.71,33.15 66.71,32.63 67.02,32.32 | 60.85,50.11 60.85,50.39 | 67.02,32.32 67.08,32.26 67.23,32.26 v67.46,32.03 67.32,31.93 67.02,32.32 | 60.85,50.39 60.85,50.54 v60.7,50.54 | 60.85,50.11 60.58,50.45 v60.7,50.54
MR2A
  Top 0.305: IC1.63 66.04,31.91 71.75,26.19 75.25,26.19 75.66,26.6 | 75.66,26.6 75.88,26.83 CON2.P$2 | 75.66,26.6 76.37,27.21 CON2.P$2 | 75.66,26.6 75.22,27.43 CON2.P$2
MR2B
  Top 0.305: IC1.64 66.54,32.05 70.81,27.78 72.14,27.78 | 72.14,27.78 CON2.P$1 | 72.14,27.78 72.88,27.2 CON2.P$1 | 72.14,27.78 72.88,28.37 CON2.P$1
MV1
  Top 0.305: IC1.78 82.29,39.45 86.56,35.18 86.56,31.37 88.76,29.17 91.95,29.17 92.55,28.57 92.55,28.54 | 92.55,28.54 TO-UNDER.19 | 92.55,28.54 92.12,27.93 TO-UNDER.19 | 92.55,28.54 92.98,27.93 TO-UNDER.19
MV2
  Top 0.305: IC1.79 82.44,39.95 87.01,35.37 87.01,31.56 88.41,30.16 89.1,30.16 | 89.1,30.16 TO-UNDER.18 | 89.1,30.16 89.7,29.73 TO-UNDER.18 | 89.1,30.16 89.7,30.6 TO-UNDER.18
MV3
  Top 0.305: IC1.80 82.58,40.45 87.47,35.56 87.47,31.75 87.95,31.27 91.92,31.27 92.19,31 | 92.19,31 92.55,30.64 TO-UNDER.17 | 92.19,31 92.03,30.28 TO-UNDER.17 | 92.19,31 92.83,30.62 TO-UNDER.17
MVS1
  Top 0.305: TO-UNDER.1 92.55,51.12 92.31,51.36 | 92.31,51.36 91.83,51.84 86.93,51.84 81.94,56.83 73.64,56.83 71.04,54.24 IC1.3 | 92.31,51.36 92.05,50.67 TO-UNDER.1 | 92.31,51.36 92.89,50.9 TO-UNDER.1
MVS2
  Top 0.305: 89.1,50.48 87.64,50.48 81.79,56.34 73.79,56.34 71.54,54.09 IC1.2 | 89.1,50.48 TO-UNDER.2 | 89.1,50.48 89.7,50.05 TO-UNDER.2 | 89.1,50.48 89.7,50.92 TO-UNDER.2
MVS3
  Top 0.305: IC1.1 72.04,53.94 73.98,55.88 81.6,55.88 88.27,49.21 91.92,49.21 92.31,48.82 | 92.31,48.82 92.55,48.58 TO-UNDER.3 | 92.31,48.82 92.05,48.13 TO-UNDER.3 | 92.31,48.82 92.89,48.36 TO-UNDER.3
N$1
  Top 0.305: IC1.62 65.54,29.95 61.71,26.11 46.15,26.11 43.46,28.8 43.46,32.35 45.09,33.97 45.09,59.37 46.67,60.96 47.45,60.96 | IC2.4 47.45,60.96 | 47.45,60.96 48,60.58 IC2.4 | 47.45,60.96 48,61.34 IC2.4
N$2